# Altium schematic sheet Schemetic.SchDoc
size A4; SheetNumber: 1; SheetTotal: 1
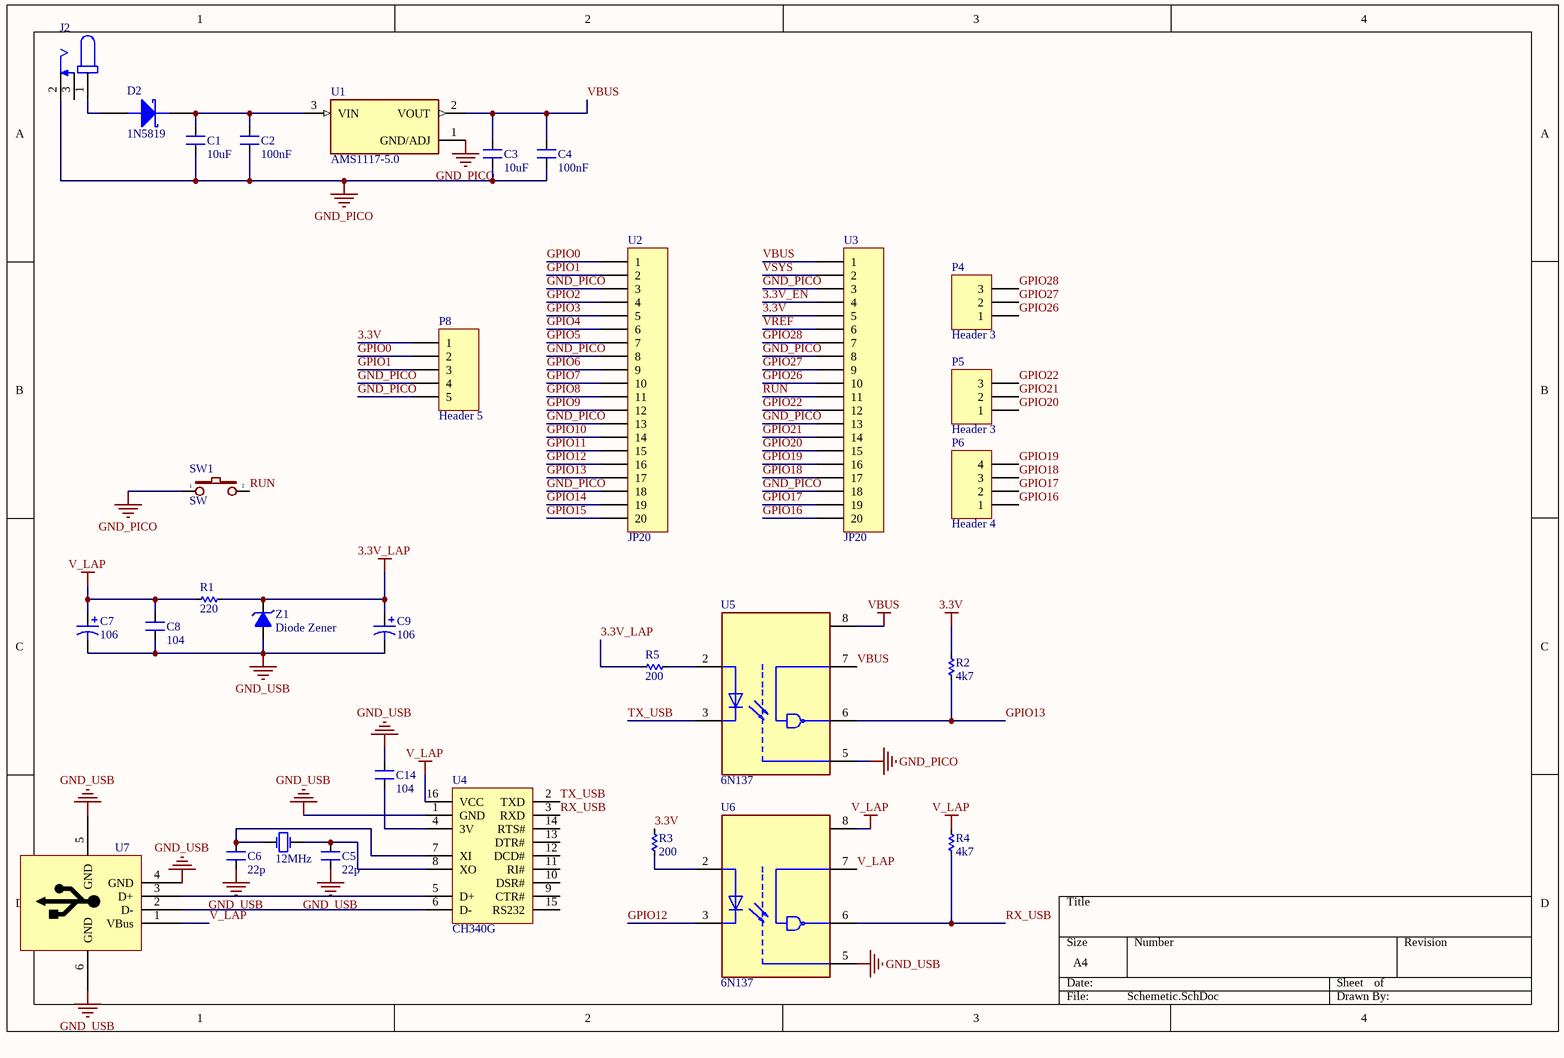
[diagram p0: Schemetic.SchDoc]

## Parts
C1  10uF  [CN2]
C2  100nF  [CN2]
C3  10uF  [CN2]
C4  100nF  [CN2]
C5  22p  [CN2]
C6  22p  [CN2]
C7  106  [C3MM]
C8  104  [CN2]
C9  106  [C3MM]
C14  104  [CN2]
D2  1N5819  [DIODE/POW/1A]
J2  (no value)  [GCT_DCJ200-10-A-XX-K_REVA]
P4  Header 3  [HDR1X3]
P5  Header 3  [HDR1X3]
P6  Header 4  [HDR1X4]
P8  Header 5  [HDR1X5]
R1  220  [RES-1/8W-SMALL-2]
R2  4k7  [RES-1/8W-SMALL-2]
R3  200  [RES-1/8W-SMALL-2]
R4  4k7  [RES-1/8W-SMALL-2]
R5  200  [RES-1/8W-SMALL-2]
SW1  SW  [SW2]
U1  AMS1117-5.0  [SOT229P700X180-4N]
U2  JP20  [JP20-C1T]
U3  JP20  [JP20-C1T]
U4  CH340G  [SO16]
U5  6N137  [DIP762W50P254L977H451Q8]
U6  6N137  [DIP762W50P254L977H451Q8]
U7  USB-A Through-Hole  [USB-A]  (value not drawn)
Y1  12MHz  [XT2]
Z1  Diode Zener  [D1A]

## Nets
3.3V: P8.1 R2.1 R3.1 U3.5
3.3V_LAP: C9.1 R1.1 R5.1 Z1.2(K)
GND_PICO: C1.1 C2.1 C3.1 C4.1 J2.2 P8.4 P8.5 SW1.1 U1.1(GND/ADJ) U2.3 U2.8 U2.13 U2.18 U3.3 U3.8 U3.13 U3.18 U5.5(GND)
GND_USB: C5.1 C6.1 C7.2 C8.1 C9.2 C14.1 U4.1(GND) U6.5(GND) U7.4(GND) U7.5(GND) U7.6(GND) Z1.1(A)
V_LAP: C7.1 C8.2 R1.2 R4.1 U4.16(VCC) U6.7(VE) U6.8(VCC) U7.1(VBus)
VBUS: C3.2 C4.2 U1.2(VOUT) U3.1 U5.7(VE) U5.8(VCC)
3.3V_EN: U3.4
GPIO0: P8.2 U2.1
GPIO1: P8.3 U2.2
GPIO2: U2.4
GPIO3: U2.5
GPIO4: U2.6
GPIO5: U2.7
GPIO6: U2.9
GPIO7: U2.10
GPIO8: U2.11
GPIO9: U2.12
GPIO10: U2.14
GPIO11: U2.15
GPIO12: U2.16 U6.3(C)
GPIO13: R2.2 U2.17 U5.6(VO)
GPIO14: U2.19
GPIO15: U2.20
GPIO16: P6.1 U3.20
GPIO17: P6.2 U3.19
GPIO18: P6.3 U3.17
GPIO19: P6.4 U3.16
GPIO20: P5.1 U3.15
GPIO21: P5.2 U3.14
GPIO22: P5.3 U3.12
GPIO26: P4.1 U3.10
GPIO27: P4.2 U3.9
GPIO28: P4.3 U3.7
RUN: SW1.2 U3.11
RX_USB: R4.2 U4.3(RXD) U6.6(VO)
TX_USB: U4.2(TXD) U5.3(C)
VREF: U3.6
VSYS: U3.2
NetC1_2: C1.2 C2.2 D2.2(K) U1.3(VIN)
NetC5_2: C5.2 U4.8(XO) Y1.1(OSC1)
NetC6_2: C6.2 U4.7(XI) Y1.2(OSC2)
NetC14_2: C14.2 U4.4(3V)
NetD2_1: D2.1(A) J2.1
NetR3_2: R3.2 U6.2(A)
NetR5_2: R5.2 U5.2(A)
NetU4_5: U4.5(D+) U7.3(D+)
NetU4_6: U4.6(D-) U7.2(D-)

Not connected (* = marked no-connect by the designer): J2 3; U4 9(CTR#) 10(DSR#) 11(RI#) 12(DCD#) 13(DTR#) 14(RTS#) 15(RS232)

## Library data of the parts
C1-C6 C8 C14 = CN2: Cap np 104 => 105pF; Value: 0.1uF
C7 C9 = Cap Pol 3mm: Polarized Capacitor (Axial); Published: 8-Jun-2000; LatestRevisionDate: 17-Jul-2002; LatestRevisionNote: Re-released for DXP Platform.; PackageReference: POLAR0.8; Publisher: Altium Limited
D2 = DIODE SCHOTTKY: Schottky Diode
J2 = DCJ200-10-A-XX-K_REVA: Power Barrel Connector Jack 2.05mm ID (0.081), 5.50mm OD (0.217) Through Hole, Right Angle; MF: Global Connector Technology; MP: DCJ200-10-A-K1-K; SnapEDA_Link: https://www.snapeda.com/parts/DCJ200-10-A-K1-K/Global+Connector+Technology/view-part/?ref=snap; Package: None; Value: *; Check_prices: https://www.snapeda.com/parts/DCJ200-10-A-K1-K/Global+Connector+Technology/view-part/?ref=eda
P4 P5 = Header 3: Header, 3-Pin; LatestRevisionDate: 17-Jul-2002; LatestRevisionNote: Re-released for DXP Platform.; Publisher: Altium Limited
P6 = Header 4: Header, 4-Pin; LatestRevisionDate: 17-Jul-2002; LatestRevisionNote: Re-released for DXP Platform.; Publisher: Altium Limited
P8 = Header 5: Header, 5-Pin; LatestRevisionDate: 17-Jul-2002; LatestRevisionNote: Re-released for DXP Platform.; Publisher: Altium Limited
R1-R5 = Res: Manufacturer: Generic Components; Class: Passive; SubClass: R; Published: 08/06/2000; Publisher: Altium Hobart Technology Centre
SW1 = SW2: Switch button 2 pin; Value: SW chip 2 pin
U1 = AMS1117-5.0: 1A LOW DROPOUT VOLTAGE REGULATOR; MF: ams; MP: AMS1117-5.0; Package: SOT-223 Seeed Technology; SnapEDA_Link: https://www.snapeda.com/parts/AMS1117-5.0/ams/view-part/?ref=snap; Check_prices: https://www.snapeda.com/parts/AMS1117-5.0/ams/view-part/?ref=eda; Availability: Not in stock; Value: *; Price: None
U2 U3 = JP20: WR-PHD 2.54 mm Angled Socket Header; Manufacturer: W¨¹rth Elektronik eiSos GmbH; partNo: 613020143121; ComponentLink1 Description: Manufacturer; ComponentLink2 Description: Datasheet; NoPins: 20; Created Date: 29 March 2013; ComponentLink1URL: http://www.we-online.com; ComponentLink2URL: http://katalog.we-online.de/em/datasheet/6130xx143121.pdf; Created by: Karrer Zheng
U4 = CH340G: High and Low Side Driver; Note: Pins 4, 8 and 14 are not connected; Published: 8-Jun-2000; LatestRevisionDate: 04-Mar-2005; LatestRevisionNote: Stylized 3D Model Added.; DatasheetVersion: PD60147J; PackageReference: PDIP14; Publisher: Altium Limited; PackageDescription: DIP; 14 Leads; Row Spacing 7.62 mm; Pitch 2.54 mm; ComponentLink1Description: Manufacturer Link; ComponentLink1URL: http://www.irf.com/; ComponentLink2Description: Datasheet; ComponentLink2URL: http://www.irf.com/product-info/datasheets/data/ir2110.pdf
U5 U6 = 6N137: Logic Output Optoisolator 10Mbps Open Collector 5000Vrms 1 Channel 5kV/Âµs CMTI 8-DIP; MF: Everlight Electronics; SnapEDA_Link: https://www.snapeda.com/parts/6N137/Everlight/view-part/?ref=snap; Package: DIP-8 Isocom; Value: *; MP: 6N137; Check_prices: https://www.snapeda.com/parts/6N137/Everlight/view-part/?ref=eda
U7 = USB-A TH
Y1 = Crystal: Crystal Oscillator; Published: 8-Jun-2000; LatestRevisionDate: 17-Jul-2002; LatestRevisionNote: Re-released for DXP Platform.; PackageReference: R38; Publisher: Altium Limited
Z1 = Diode Zener: Diode  Zener